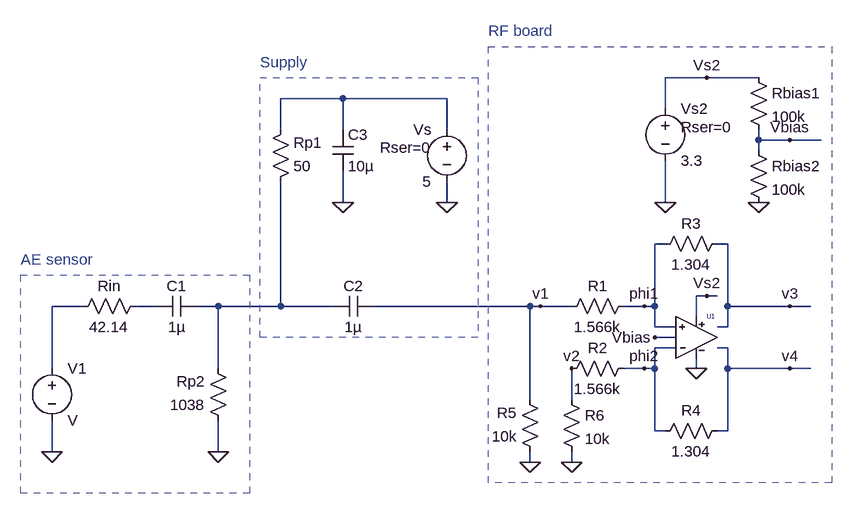
[diagram p0: schematic AE PKWDI - opamp.asc]
AE PKWDI - opamp.asc, the LTspice schematic file:
Version 4
SHEET 1 1124 680
WIRE 928 -288 864 -288
WIRE 1008 -288 928 -288
WIRE 368 -256 272 -256
WIRE 528 -256 368 -256
WIRE 864 -240 864 -288
WIRE 272 -208 272 -256
WIRE 368 -208 368 -256
WIRE 528 -208 528 -256
WIRE 1008 -192 1008 -208
WIRE 1056 -192 1008 -192
WIRE 1104 -192 1056 -192
WIRE 1008 -176 1008 -192
WIRE 368 -96 368 -144
WIRE 528 -96 528 -128
WIRE 864 -96 864 -160
WIRE 864 -32 848 -32
WIRE 960 -32 944 -32
WIRE 928 48 912 48
WIRE 944 48 928 48
WIRE -32 64 -80 64
WIRE 80 64 48 64
WIRE 176 64 144 64
WIRE 272 64 272 -128
WIRE 272 64 176 64
WIRE 352 64 272 64
WIRE 656 64 416 64
WIRE 672 64 656 64
WIRE 720 64 672 64
WIRE 832 64 800 64
WIRE 848 64 848 -32
WIRE 848 64 832 64
WIRE 960 64 960 -32
WIRE 1056 64 960 64
WIRE 1088 64 1056 64
WIRE 912 80 912 48
WIRE 848 96 848 64
WIRE 880 96 848 96
WIRE 960 96 960 64
WIRE 960 96 944 96
WIRE 880 112 848 112
WIRE 880 128 848 128
WIRE 960 128 944 128
WIRE -80 160 -80 64
WIRE 176 160 176 64
WIRE 832 160 800 160
WIRE 848 160 848 128
WIRE 848 160 832 160
WIRE 912 160 912 144
WIRE 960 160 960 128
WIRE 1056 160 960 160
WIRE 1088 160 1056 160
WIRE 656 208 656 64
WIRE 720 208 720 160
WIRE 848 256 848 160
WIRE 864 256 848 256
WIRE 960 256 960 160
WIRE 960 256 944 256
WIRE -80 288 -80 240
WIRE 176 288 176 240
WIRE 656 304 656 288
WIRE 720 304 720 288
FLAG -80 288 0
FLAG 176 288 0
FLAG 656 304 0
FLAG 720 304 0
FLAG 528 -96 0
FLAG 368 -96 0
FLAG 672 64 v1
FLAG 720 160 v2
FLAG 912 160 0
FLAG 864 -96 0
FLAG 928 -288 Vs2
FLAG 928 48 Vs2
FLAG 1056 64 v3
FLAG 1056 160 v4
FLAG 848 112 Vbias
FLAG 1008 -96 0
FLAG 1056 -192 Vbias
FLAG 832 64 phi1
FLAG 832 160 phi2
SYMBOL voltage -80 144 R0
SYMATTR InstName V1
SYMBOL res 64 48 R90
WINDOW 0 0 56 VBottom 2
WINDOW 3 32 56 VTop 2
SYMATTR InstName Rin
SYMATTR Value 42.14
SYMBOL res 192 256 R180
WINDOW 0 36 76 Left 2
WINDOW 3 36 40 Left 2
SYMATTR InstName Rp2
SYMATTR Value 1038
SYMATTR SpiceLine ""
SYMBOL res 256 -112 M180
WINDOW 0 36 76 Left 2
WINDOW 3 36 40 Left 2
SYMATTR InstName Rp1
SYMATTR Value 50
SYMATTR SpiceLine ""
SYMBOL res 672 304 R180
WINDOW 0 36 76 Left 2
WINDOW 3 36 40 Left 2
SYMATTR InstName R5
SYMATTR Value 10k
SYMBOL res 704 80 R270
WINDOW 0 32 56 VTop 2
WINDOW 3 0 56 VBottom 2
SYMATTR InstName R1
SYMATTR Value 1.566k
SYMBOL res 704 192 R0
SYMATTR InstName R6
SYMATTR Value 10k
SYMBOL res 816 144 R90
WINDOW 0 0 56 VBottom 2
WINDOW 3 32 56 VTop 2
SYMATTR InstName R2
SYMATTR Value 1.566k
SYMBOL res 960 -48 R90
WINDOW 0 0 56 VBottom 2
WINDOW 3 32 56 VTop 2
SYMATTR InstName R3
SYMATTR Value 1.304
SYMBOL res 960 240 R90
WINDOW 0 0 56 VBottom 2
WINDOW 3 32 56 VTop 2
SYMATTR InstName R4
SYMATTR Value 1.304
SYMBOL cap 144 48 R90
WINDOW 0 0 32 VBottom 2
WINDOW 3 32 32 VTop 2
SYMATTR InstName C1
SYMATTR Value 1µ
SYMATTR SpiceLine ""
SYMBOL cap 416 48 R90
WINDOW 0 0 32 VBottom 2
WINDOW 3 32 32 VTop 2
SYMATTR InstName C2
SYMATTR Value 1µ
SYMATTR SpiceLine ""
SYMBOL cap 352 -144 M180
WINDOW 0 24 56 Left 2
WINDOW 3 24 8 Left 2
SYMATTR InstName C3
SYMATTR Value 10µ
SYMATTR SpiceLine ""
SYMBOL voltage 528 -224 M0
WINDOW 123 0 0 Left 2
WINDOW 39 24 44 Left 2
SYMATTR Value2 ""
SYMATTR SpiceLine Rser=0
SYMATTR InstName Vs
SYMATTR Value 5
SYMBOL ad8132 912 112 R0
SYMATTR InstName U1
SYMBOL voltage 864 -256 R0
WINDOW 123 0 0 Left 2
WINDOW 39 24 44 Left 2
SYMATTR Value2 ""
SYMATTR SpiceLine Rser=0
SYMATTR InstName Vs2
SYMATTR Value 3.3
SYMBOL res 992 -192 R0
SYMATTR InstName Rbias2
SYMATTR Value 100k
SYMATTR SpiceLine ""
SYMBOL res 992 -304 R0
SYMATTR InstName Rbias1
SYMATTR Value 100k
SYMATTR SpiceLine ""
TEXT 592 -360 Left 2 ;RF board
TEXT 240 -312 Left 2 ;Supply
TEXT -128 -8 Left 2 ;AE sensor
RECTANGLE Normal 224 352 -128 16 2
RECTANGLE Normal 240 -288 576 112 2
RECTANGLE Normal 1120 336 592 -336 2

The netlist it stands for:
* AE PKWDI - opamp.asc
V1 N002 0 V
Rin N003 N002 42.14
Rp2 0 N004 1038
Rp1 N004 N001 50
R5 0 v1 10k
R1 v1 phi1 1.566k
R6 v2 0 10k
R2 phi2 v2 1.566k
R3 v3 phi1 1.304
R4 v4 phi2 1.304
C1 N004 N003 1µ
C2 v1 N004 1µ
C3 0 N001 10µ
Vs N001 0 5 Rser=0
XU1 phi1 phi2 Vs2 0 v3 v4 Vbias AD8132  ; pins In+ In- V+ V- OUT- OUT+ VOCM
Vs2 Vs2 0 3.3 Rser=0
Rbias2 Vbias 0 100k
Rbias1 Vs2 Vbias 100k
* RF board
* Supply
* AE sensor
.lib ad8132.cir
.backanno
.end